# Altium schematic sheet Astavel and Monostable Clock Circuit - 2.0_2021-10-20.schdoc
size 264 x 204 mm
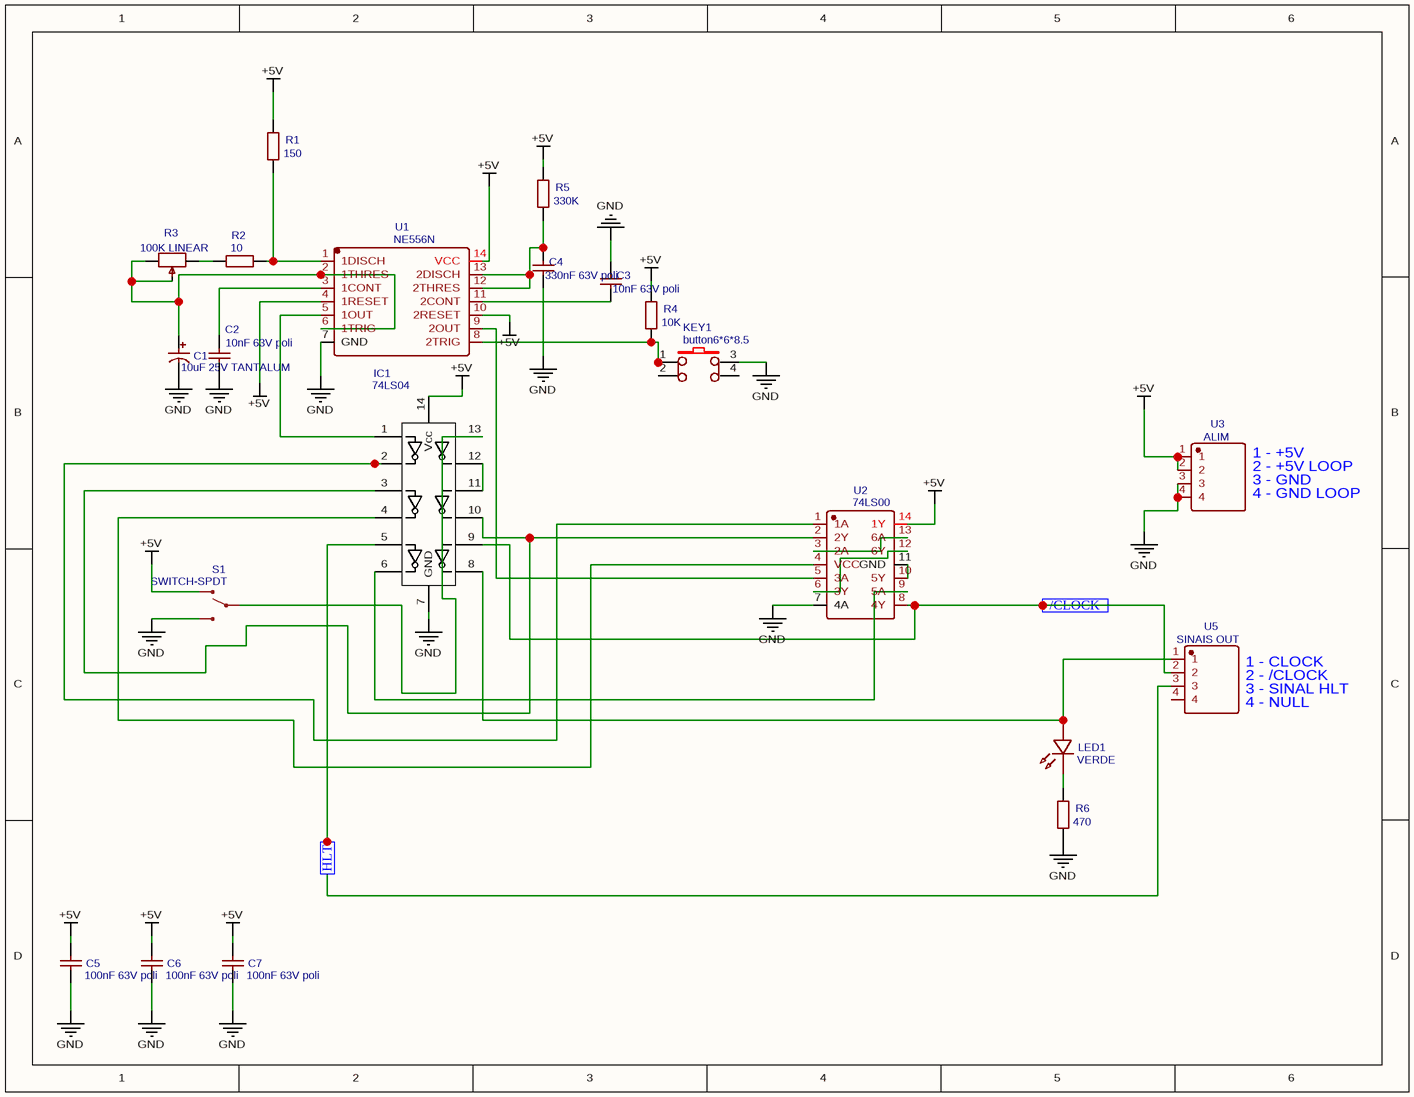
[diagram p0: Astavel and Monostable Clock Circuit - 2.0_2021-10-20.schdoc]

## Parts
C1  10uF 25V TANTALUM  [CAP-TH_BD4.0-P1.50-D0.8-FD]
C2  10nF 63V poli  [CAP-TH_L5.5-W3.0-P5.00-D0.5]
C3  10nF 63V poli  [CAP-TH_L5.5-W3.0-P5.00-D0.5]
C4  330nF 63V poli  [CAP-TH_L5.5-W3.0-P5.00-D0.5]
C5  100nF 63V poli  [CAP-TH_L5.5-W3.0-P5.00-D0.5]
C6  100nF 63V poli  [CAP-TH_L5.5-W3.0-P5.00-D0.5]
C7  100nF 63V poli  [CAP-TH_L5.5-W3.0-P5.00-D0.5]
IC1  74LS04  [DIL-14]
KEY1  button6*6*8.5  [KEY-TH_4P-L6.0-W6.0-P4.50]
LED1  VERDE  [LED-TH_BD3.0-P2.54-RD-GREEN]
R1  150  [RES-TH_BD3.0-L9.5-P13.50-D0.6]
R2  10  [RES-TH_BD3.0-L9.5-P13.50-D0.6]
R3  100K LINEAR  [RES-ADJ-TH_3362P]
R4  10K  [RES-TH_BD3.0-L9.5-P13.50-D0.6]
R5  330K  [RES-TH_BD3.0-L9.5-P13.50-D0.6]
R6  470  [RES-TH_BD3.0-L9.5-P13.50-D0.6]
S1  SWITCH-SPDT  [SWITCH-SPDT-SMD]
U1  NE556N  [DIP-14_L19.0-W7.0-P2.54-LS7.6-BL]
U2  74LS00  [DIP-14_L19.4-W6.4-P2.54-LS7.6-BL]
U3  ALIM  [HDR-TH_4P-P2.54-D1.0]
U5  SINAIS OUT  [HDR-TH_4P-P2.54-D1.0]

## Ports
/CLOCK (in), HLT (in)

## Nets
+5V: C5.1 C6.1 C7.1 IC1.14(Vcc) R1.1 R4.1 R5.1 S1.1(O) U1.4(1RESET) U1.10(2RESET) U1.14(VCC) U2.14(1Y) U3.1 U3.2
GND: C1.2 C2.2 C3.1 C4.2 C5.2 C6.2 C7.2 IC1.7(GND) KEY1.3 R6.2 S1.3(S) U1.7(GND) U2.7(4A) U3.3 U3.4
/CLOCK: IC1.9 U2.8(4Y) U5.2 ; port /CLOCK
HLT: IC1.5 U5.3 ; port HLT
NetC1_1: C1.1 R3.1 R3.2 U1.2(1THRES) U1.6(1TRIG)
NetC2_1: C2.1 U1.3(1CONT)
NetC3_2: C3.2 U1.11(2CONT)
NetC4_1: C4.1 R5.2 U1.12(2THRES) U1.13(2DISCH)
NetIC1_1: IC1.1 U1.5(1OUT)
NetIC1_2: IC1.2 U2.1(1A)
NetIC1_3: IC1.3 IC1.10 U2.2(2Y)
NetIC1_4: IC1.4 U2.4(VCC)
NetIC1_6: IC1.6 U2.9(5A)
NetIC1_8: IC1.8 LED1.2(+) U5.1
NetIC1_11: IC1.11 IC1.12
NetIC1_13: IC1.13 S1.2(P)
NetKEY1_1: KEY1.1 R4.2 U1.8(2TRIG)
NetLED1_1: LED1.1(-) R6.1
NetR1_2: R1.2 R2.1 U1.1(1DISCH)
NetR2_2: R2.2 R3.3
NetU1_9: U1.9(2OUT) U2.5(3A)
NetU2_3: U2.3(2A) U2.13(6A)
NetU2_6: U2.6(3Y) U2.12(6Y)
NetU2_10: U2.10(5Y) U2.11(GND)

Not connected (* = marked no-connect by the designer): KEY1 2 4; U5 4

## Notes on the sheet
- 2 - +5V LOOP
- 4 - GND LOOP
- 3 - GND
- 1 - +5V
- 1 - CLOCK
- 2 - /CLOCK
- 3 - SINAL HLT
- 4 - NULL

## Library data of the parts
C1 = 10uF 25V TANTALUM: BOM_Manufacturer: CapXon; BOM_Manufacturer Part: SK100M035B070A; nameAlias: Capacitance; BOM_Supplier: LCSC; BOM_Supplier Part: C62931; BOM_JLCPCB Part Class: Extended Part; spicePre: C; spiceSymbolName: SK100M035B070A
C2 C3 = 10nF 63V poli: BOM_Manufacturer: ReliaPro; BOM_Manufacturer Part: 0.01uF(103) 100V; nameAlias: Capacitance; BOM_Supplier: LCSC; BOM_Supplier Part: C10722; spicePre: C; spiceSymbolName: 0.01uF(103) 100V
C4 = 330nF 63V poli: BOM_Manufacturer: ReliaPro; BOM_Manufacturer Part: 0.01uF(103) 100V; nameAlias: Capacitance; BOM_Supplier: LCSC; BOM_Supplier Part: C10722; spicePre: C; spiceSymbolName: 0.01uF(103) 100V
C5-C7 = 100nF 63V poli: BOM_Manufacturer: ReliaPro; BOM_Manufacturer Part: 0.01uF(103) 100V; nameAlias: Capacitance; BOM_Supplier: LCSC; BOM_Supplier Part: C10722; spicePre: C; spiceSymbolName: 0.01uF(103) 100V
IC1 = 74LS04: Contributor: keyboardjunkie; spicePre: I; spiceSymbolName: DM74LS04N
KEY1 = button6*6*8.5: BOM_Manufacturer: ReliaPro; BOM_Supplier Part: C59980; BOM_Supplier: LCSC; BOM_Manufacturer Part: button6*6*8.5; spicePre: K; spiceSymbolName: button6*6*8.5
LED1 = VERDE: BOM_Manufacturer: Everlight Elec; BOM_Manufacturer Part: 264-7GD; Contributor: LCSC; BOM_Supplier: LCSC; BOM_Supplier Part: C605465; BOM_JLCPCB Part Class: Extended Part; spicePre: L; spiceSymbolName: 264-7GD
R1 = 150: BOM_Manufacturer Part: 7501/2w5%; nameAlias: Resistance (Ohms); BOM_Supplier: LCSC; BOM_Supplier Part: C48642; spicePre: R; spiceSymbolName: 750Ω
R2 = 10: BOM_Manufacturer Part: 7501/2w5%; nameAlias: Resistance (Ohms); BOM_Supplier: LCSC; BOM_Supplier Part: C48642; spicePre: R; spiceSymbolName: 750Ω
R3 = 100K LINEAR: BOM_Manufacturer: BOURNS; BOM_Manufacturer Part: 3362P-1-502LF; nameAlias: Resistance (Ohms); Resistance(Ohms): 5K; BOM_Supplier: LCSC; BOM_Supplier Part: C81260; spicePre: R; spiceSymbolName: 3362P-1-502LF
R4 = 10K: BOM_Manufacturer Part: 7501/2w5%; nameAlias: Resistance (Ohms); BOM_Supplier: LCSC; BOM_Supplier Part: C48642; spicePre: R; spiceSymbolName: 750Ω
R5 = 330K: BOM_Manufacturer Part: 7501/2w5%; nameAlias: Resistance (Ohms); BOM_Supplier: LCSC; BOM_Supplier Part: C48642; spicePre: R; spiceSymbolName: 750Ω
R6 = 470: BOM_Manufacturer Part: 7501/2w5%; nameAlias: Resistance (Ohms); BOM_Supplier: LCSC; BOM_Supplier Part: C48642; spicePre: R; spiceSymbolName: 750Ω
S1 = SWITCH-SPDT: Contributor: SparkFun; spicePre: S; spiceSymbolName: SWITCH-SPDT
U1 = NE556N: BOM_Manufacturer: TI; BOM_Supplier: LCSC; BOM_Manufacturer Part: NE556N; BOM_Supplier Part: C66175; BOM_JLCPCB Part Class: Extended Part; spicePre: U; spiceSymbolName: NE556N
U2 = 74LS00: BOM_Manufacturer: XINLUDA(信路达); BOM_Manufacturer Part: XD74LS04; Contributor: LCSC; BOM_Supplier: LCSC; BOM_Supplier Part: C513524; BOM_JLCPCB Part Class: Extended Part; spicePre: U; spiceSymbolName: XD74LS04
U3 = ALIM: BOM_Manufacturer: TE Connectivity; BOM_Manufacturer Part: 171825-4; Contributor: LCSC; BOM_Supplier: LCSC; BOM_Supplier Part: C210162; BOM_JLCPCB Part Class: Extended Part; spicePre: U; spiceSymbolName: 171825-4
U5 = SINAIS OUT: BOM_Manufacturer: TE Connectivity; BOM_Manufacturer Part: 171825-4; Contributor: LCSC; BOM_Supplier: LCSC; BOM_Supplier Part: C210162; BOM_JLCPCB Part Class: Extended Part; spicePre: U; spiceSymbolName: 171825-4